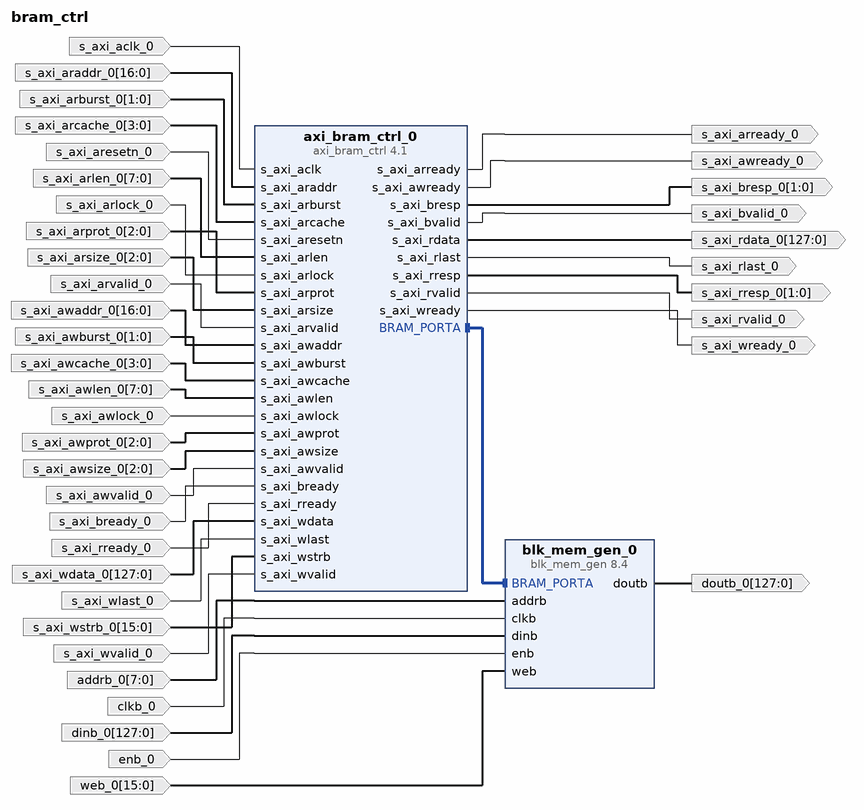
[diagram p0: block diagram of the top level]
# Vivado block design bram_ctrl, xczu7ev-ffvc1156-2-e, Vivado 2024.2
create_bd_design bram_ctrl

create_bd_port -dir I -from 7 -to 0 addrb_0
create_bd_port -dir I -type clk clkb_0
create_bd_port -dir I -from 127 -to 0 dinb_0
create_bd_port -dir O -from 127 -to 0 doutb_0
create_bd_port -dir I enb_0
create_bd_port -dir I -from 15 -to 0 web_0
create_bd_port -dir I -type clk s_axi_aclk_0
create_bd_port -dir I -from 16 -to 0 s_axi_araddr_0
create_bd_port -dir I -from 1 -to 0 s_axi_arburst_0
create_bd_port -dir I -from 3 -to 0 s_axi_arcache_0
create_bd_port -dir I -type rst s_axi_aresetn_0
create_bd_port -dir I -from 7 -to 0 s_axi_arlen_0
create_bd_port -dir I s_axi_arlock_0
create_bd_port -dir I -from 2 -to 0 s_axi_arprot_0
create_bd_port -dir O s_axi_arready_0
create_bd_port -dir I -from 2 -to 0 s_axi_arsize_0
create_bd_port -dir I s_axi_arvalid_0
create_bd_port -dir I -from 16 -to 0 s_axi_awaddr_0
create_bd_port -dir I -from 1 -to 0 s_axi_awburst_0
create_bd_port -dir I -from 3 -to 0 s_axi_awcache_0
create_bd_port -dir I -from 7 -to 0 s_axi_awlen_0
create_bd_port -dir I s_axi_awlock_0
create_bd_port -dir I -from 2 -to 0 s_axi_awprot_0
create_bd_port -dir O s_axi_awready_0
create_bd_port -dir I -from 2 -to 0 s_axi_awsize_0
create_bd_port -dir I s_axi_awvalid_0
create_bd_port -dir I s_axi_bready_0
create_bd_port -dir O -from 1 -to 0 s_axi_bresp_0
create_bd_port -dir O s_axi_bvalid_0
create_bd_port -dir O -from 127 -to 0 s_axi_rdata_0
create_bd_port -dir O s_axi_rlast_0
create_bd_port -dir I s_axi_rready_0
create_bd_port -dir O -from 1 -to 0 s_axi_rresp_0
create_bd_port -dir O s_axi_rvalid_0
create_bd_port -dir I -from 127 -to 0 s_axi_wdata_0
create_bd_port -dir I s_axi_wlast_0
create_bd_port -dir O s_axi_wready_0
create_bd_port -dir I -from 15 -to 0 s_axi_wstrb_0
create_bd_port -dir I s_axi_wvalid_0

create_bd_cell -type ip -vlnv xilinx.com:ip:axi_bram_ctrl:4.1 axi_bram_ctrl_0
set_property -dict {CONFIG.DATA_WIDTH 128 CONFIG.SINGLE_PORT_BRAM 1} [get_bd_cells axi_bram_ctrl_0]
create_bd_cell -type ip -vlnv xilinx.com:ip:blk_mem_gen:8.4 blk_mem_gen_0
set_property -dict [list \
  CONFIG.Byte_Size 8 \
  CONFIG.Enable_32bit_Address false \
  CONFIG.Memory_Type True_Dual_Port_RAM \
  CONFIG.Register_PortA_Output_of_Memory_Primitives false \
  CONFIG.Register_PortB_Output_of_Memory_Primitives false \
  CONFIG.Use_Byte_Write_Enable true \
  CONFIG.Write_Depth_A 256 \
  CONFIG.Write_Width_A 128 \
  CONFIG.use_bram_block Stand_Alone \
] [get_bd_cells blk_mem_gen_0]

# ---- connections ----

connect_bd_intf_net [get_bd_intf_pins blk_mem_gen_0/BRAM_PORTA] [get_bd_intf_pins axi_bram_ctrl_0/BRAM_PORTA]
connect_bd_net -net addrb_0_1 [get_bd_ports addrb_0] [get_bd_pins blk_mem_gen_0/addrb]
connect_bd_net [get_bd_pins axi_bram_ctrl_0/s_axi_arready] [get_bd_ports s_axi_arready_0]
connect_bd_net [get_bd_pins axi_bram_ctrl_0/s_axi_awready] [get_bd_ports s_axi_awready_0]
connect_bd_net [get_bd_pins axi_bram_ctrl_0/s_axi_bresp] [get_bd_ports s_axi_bresp_0]
connect_bd_net [get_bd_pins axi_bram_ctrl_0/s_axi_bvalid] [get_bd_ports s_axi_bvalid_0]
connect_bd_net [get_bd_pins axi_bram_ctrl_0/s_axi_rdata] [get_bd_ports s_axi_rdata_0]
connect_bd_net [get_bd_pins axi_bram_ctrl_0/s_axi_rlast] [get_bd_ports s_axi_rlast_0]
connect_bd_net [get_bd_pins axi_bram_ctrl_0/s_axi_rresp] [get_bd_ports s_axi_rresp_0]
connect_bd_net [get_bd_pins axi_bram_ctrl_0/s_axi_rvalid] [get_bd_ports s_axi_rvalid_0]
connect_bd_net [get_bd_pins axi_bram_ctrl_0/s_axi_wready] [get_bd_ports s_axi_wready_0]
connect_bd_net [get_bd_pins blk_mem_gen_0/doutb] [get_bd_ports doutb_0]
connect_bd_net -net clkb_0_1 [get_bd_ports clkb_0] [get_bd_pins blk_mem_gen_0/clkb]
connect_bd_net -net dinb_0_1 [get_bd_ports dinb_0] [get_bd_pins blk_mem_gen_0/dinb]
connect_bd_net -net enb_0_1 [get_bd_ports enb_0] [get_bd_pins blk_mem_gen_0/enb]
connect_bd_net -net s_axi_aclk_0_1 [get_bd_ports s_axi_aclk_0] [get_bd_pins axi_bram_ctrl_0/s_axi_aclk]
connect_bd_net -net s_axi_araddr_0_1 [get_bd_ports s_axi_araddr_0] [get_bd_pins axi_bram_ctrl_0/s_axi_araddr]
connect_bd_net -net s_axi_arburst_0_1 [get_bd_ports s_axi_arburst_0] [get_bd_pins axi_bram_ctrl_0/s_axi_arburst]
connect_bd_net -net s_axi_arcache_0_1 [get_bd_ports s_axi_arcache_0] [get_bd_pins axi_bram_ctrl_0/s_axi_arcache]
connect_bd_net -net s_axi_aresetn_0_1 [get_bd_ports s_axi_aresetn_0] [get_bd_pins axi_bram_ctrl_0/s_axi_aresetn]
connect_bd_net -net s_axi_arlen_0_1 [get_bd_ports s_axi_arlen_0] [get_bd_pins axi_bram_ctrl_0/s_axi_arlen]
connect_bd_net -net s_axi_arlock_0_1 [get_bd_ports s_axi_arlock_0] [get_bd_pins axi_bram_ctrl_0/s_axi_arlock]
connect_bd_net -net s_axi_arprot_0_1 [get_bd_ports s_axi_arprot_0] [get_bd_pins axi_bram_ctrl_0/s_axi_arprot]
connect_bd_net -net s_axi_arsize_0_1 [get_bd_ports s_axi_arsize_0] [get_bd_pins axi_bram_ctrl_0/s_axi_arsize]
connect_bd_net -net s_axi_arvalid_0_1 [get_bd_ports s_axi_arvalid_0] [get_bd_pins axi_bram_ctrl_0/s_axi_arvalid]
connect_bd_net -net s_axi_awaddr_0_1 [get_bd_ports s_axi_awaddr_0] [get_bd_pins axi_bram_ctrl_0/s_axi_awaddr]
connect_bd_net -net s_axi_awburst_0_1 [get_bd_ports s_axi_awburst_0] [get_bd_pins axi_bram_ctrl_0/s_axi_awburst]
connect_bd_net -net s_axi_awcache_0_1 [get_bd_ports s_axi_awcache_0] [get_bd_pins axi_bram_ctrl_0/s_axi_awcache]
connect_bd_net -net s_axi_awlen_0_1 [get_bd_ports s_axi_awlen_0] [get_bd_pins axi_bram_ctrl_0/s_axi_awlen]
connect_bd_net -net s_axi_awlock_0_1 [get_bd_ports s_axi_awlock_0] [get_bd_pins axi_bram_ctrl_0/s_axi_awlock]
connect_bd_net -net s_axi_awprot_0_1 [get_bd_ports s_axi_awprot_0] [get_bd_pins axi_bram_ctrl_0/s_axi_awprot]
connect_bd_net -net s_axi_awsize_0_1 [get_bd_ports s_axi_awsize_0] [get_bd_pins axi_bram_ctrl_0/s_axi_awsize]
connect_bd_net -net s_axi_awvalid_0_1 [get_bd_ports s_axi_awvalid_0] [get_bd_pins axi_bram_ctrl_0/s_axi_awvalid]
connect_bd_net -net s_axi_bready_0_1 [get_bd_ports s_axi_bready_0] [get_bd_pins axi_bram_ctrl_0/s_axi_bready]
connect_bd_net -net s_axi_rready_0_1 [get_bd_ports s_axi_rready_0] [get_bd_pins axi_bram_ctrl_0/s_axi_rready]
connect_bd_net -net s_axi_wdata_0_1 [get_bd_ports s_axi_wdata_0] [get_bd_pins axi_bram_ctrl_0/s_axi_wdata]
connect_bd_net -net s_axi_wlast_0_1 [get_bd_ports s_axi_wlast_0] [get_bd_pins axi_bram_ctrl_0/s_axi_wlast]
connect_bd_net -net s_axi_wstrb_0_1 [get_bd_ports s_axi_wstrb_0] [get_bd_pins axi_bram_ctrl_0/s_axi_wstrb]
connect_bd_net -net s_axi_wvalid_0_1 [get_bd_ports s_axi_wvalid_0] [get_bd_pins axi_bram_ctrl_0/s_axi_wvalid]
connect_bd_net -net web_0_1 [get_bd_ports web_0] [get_bd_pins blk_mem_gen_0/web]

validate_bd_design
save_bd_design
